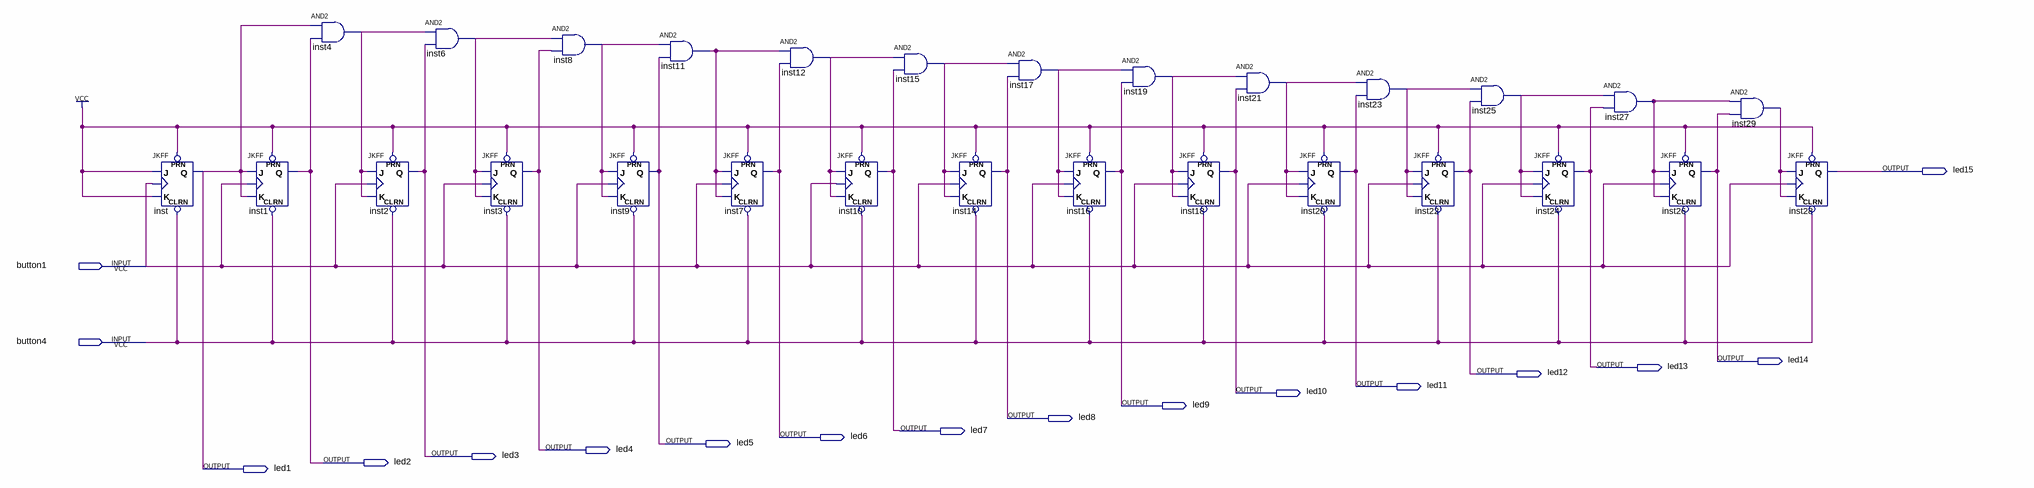
[diagram p0: schematic sheet]
// Quartus schematic Counter_15bit.bdf as structural Verilog: 28 symbols, 17 pins
module Counter_15bit (
  input  button1,
  input  button4,
  output led15,
  output led14,
  output led13,
  output led12,
  output led11,
  output led10,
  output led9,
  output led8,
  output led7,
  output led6,
  output led5,
  output led4,
  output led3,
  output led2,
  output led1
);

  wire inst4_out, inst6_out, inst8_out, inst11_out, inst12_out, inst15_out, inst17_out, inst19_out,
       inst21_out, inst23_out, inst25_out, inst27_out, inst29_out;

  JKFF inst (.PRN(1'b1), .CLRN(button4), .K(1'b1), .J(1'b1), .CLK(button1), .Q(led1));
  JKFF inst1 (.PRN(1'b1), .CLRN(button4), .K(led1), .J(led1), .CLK(button1), .Q(led2));
  and inst4 (inst4_out, led1, led2);
  JKFF inst2 (.PRN(1'b1), .CLRN(button4), .K(inst4_out), .J(inst4_out), .CLK(button1), .Q(led3));
  and inst6 (inst6_out, inst4_out, led3);
  JKFF inst3 (.PRN(1'b1), .CLRN(button4), .K(inst6_out), .J(inst6_out), .CLK(button1), .Q(led4));
  and inst8 (inst8_out, inst6_out, led4);
  JKFF inst9 (.PRN(1'b1), .CLRN(button4), .K(inst8_out), .J(inst8_out), .CLK(button1), .Q(led5));
  and inst11 (inst11_out, inst8_out, led5);
  JKFF inst7 (.PRN(1'b1), .CLRN(button4), .K(inst11_out), .J(inst11_out), .CLK(button1), .Q(led6));
  and inst12 (inst12_out, inst11_out, led6);
  JKFF inst10 (.PRN(1'b1), .CLRN(button4), .K(inst12_out), .J(inst12_out), .CLK(button1), .Q(led7));
  and inst15 (inst15_out, inst12_out, led7);
  JKFF inst14 (.PRN(1'b1), .CLRN(button4), .K(inst15_out), .J(inst15_out), .CLK(button1), .Q(led8));
  and inst17 (inst17_out, inst15_out, led8);
  JKFF inst16 (.PRN(1'b1), .CLRN(button4), .K(inst17_out), .J(inst17_out), .CLK(button1), .Q(led9));
  and inst19 (inst19_out, inst17_out, led9);
  JKFF inst18 (.PRN(1'b1), .CLRN(button4), .K(inst19_out), .J(inst19_out), .CLK(button1), .Q(led10));
  and inst21 (inst21_out, inst19_out, led10);
  JKFF inst20 (.PRN(1'b1), .CLRN(button4), .K(inst21_out), .J(inst21_out), .CLK(button1), .Q(led11));
  and inst23 (inst23_out, inst21_out, led11);
  JKFF inst22 (.PRN(1'b1), .CLRN(button4), .K(inst23_out), .J(inst23_out), .CLK(button1), .Q(led12));
  and inst25 (inst25_out, inst23_out, led12);
  JKFF inst24 (.PRN(1'b1), .CLRN(button4), .K(inst25_out), .J(inst25_out), .CLK(button1), .Q(led13));
  and inst27 (inst27_out, inst25_out, led13);
  JKFF inst26 (.PRN(1'b1), .CLRN(button4), .K(inst27_out), .J(inst27_out), .CLK(button1), .Q(led14));
  and inst29 (inst29_out, inst27_out, led14);
  JKFF inst28 (.PRN(1'b1), .CLRN(button4), .K(inst29_out), .J(inst29_out), .CLK(button1), .Q(led15));
endmodule
